# Altium schematic sheet Sheet2.SchDoc
size A4
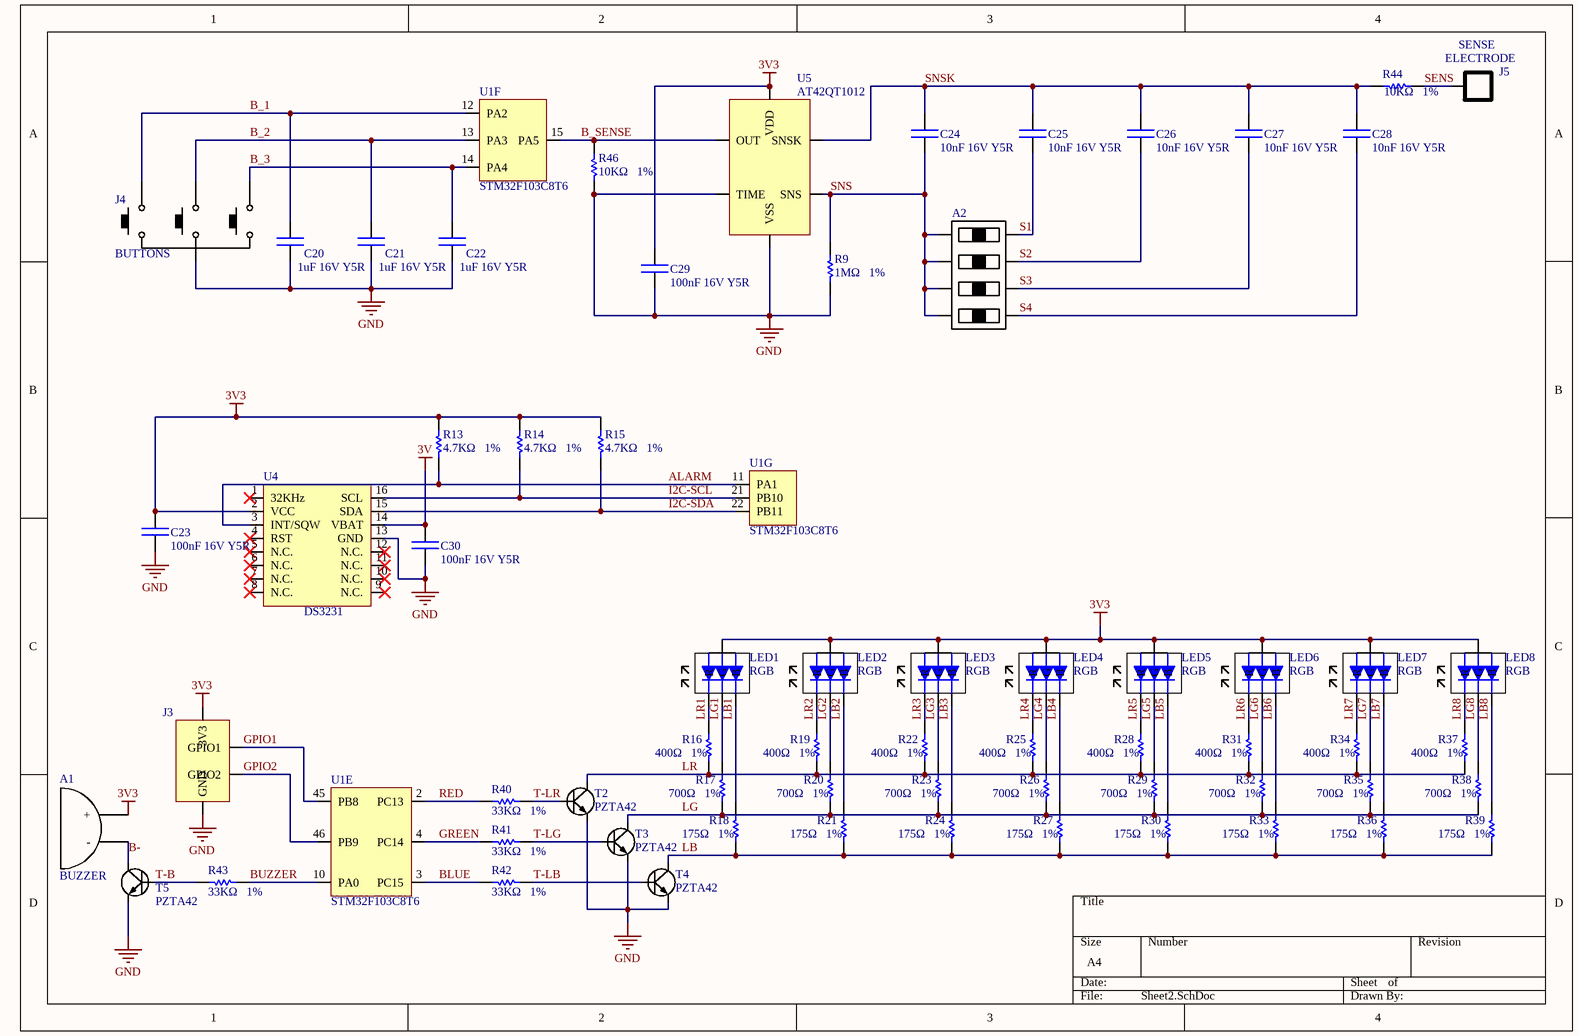
[diagram p0: Sheet2.SchDoc]

## Parts
A1  BUZZER  [BUZZER]
A2  DIP-SWITCHx4  [DIP-SWITCH-X4-J-BEND]  (value not drawn)
C20  1uF 16V Y5R  [0603]
C21  1uF 16V Y5R  [0603]
C22  1uF 16V Y5R  [0603]
C23  100nF 16V Y5R  [0603]
C24  10nF 16V Y5R  [0603]
C25  10nF 16V Y5R  [0603]
C26  10nF 16V Y5R  [0603]
C27  10nF 16V Y5R  [0603]
C28  10nF 16V Y5R  [0603]
C29  100nF 16V Y5R  [0603]
C30  100nF 16V Y5R  [0603]
J3  GPIO  [PIN-HEADERx4-]  (value not drawn)
J4  BUTTONS  [BORNERAx4]
J5  ELECTRODE  [BORNERAx2]
LED1  RGB  [1205-RGB]
LED2  RGB  [1205-RGB]
LED3  RGB  [1205-RGB]
LED4  RGB  [1205-RGB]
LED5  RGB  [1205-RGB]
LED6  RGB  [1205-RGB]
LED7  RGB  [1205-RGB]
LED8  RGB  [1205-RGB]
R9  1MΩ   1%  [0603]
R13  4.7KΩ   1%  [0603]
R14  4.7KΩ   1%  [0603]
R15  4.7KΩ   1%  [0603]
R16  400Ω   1%  [0603]
R17  700Ω   1%  [0603]
R18  175Ω   1%  [0603]
R19  400Ω   1%  [0603]
R20  700Ω   1%  [0603]
R21  175Ω   1%  [0603]
R22  400Ω   1%  [0603]
R23  700Ω   1%  [0603]
R24  175Ω   1%  [0603]
R25  400Ω   1%  [0603]
R26  700Ω   1%  [0603]
R27  175Ω   1%  [0603]
R28  400Ω   1%  [0603]
R29  700Ω   1%  [0603]
R30  175Ω   1%  [0603]
R31  400Ω   1%  [0603]
R32  700Ω   1%  [0603]
R33  175Ω   1%  [0603]
R34  400Ω   1%  [0603]
R35  700Ω   1%  [0603]
R36  175Ω   1%  [0603]
R37  400Ω   1%  [0603]
R38  700Ω   1%  [0603]
R39  175Ω   1%  [0603]
R40  33KΩ   1%  [0603]
R41  33KΩ   1%  [0603]
R42  33KΩ   1%  [0603]
R43  33KΩ   1%  [0603]
R44  10KΩ   1%  [0603]
R46  10KΩ   1%  [0603]
T2  PZTA42  [SOT-23]
T3  PZTA42  [SOT-23]
T4  PZTA42  [SOT-23]
T5  PZTA42  [SOT-23]
U1  STM32F103C8T6  [LQFP48]  (parts E,F,G of 8)
U4  DS3231  [SO16W]
U5  AT42QT1012  [SOT-23-6]

## Nets
3V: C30.2 U4.14(VBAT)
3V3: A1.1(+) C23.2 C29.1 J3.1(3V3) LED1.2(A) LED2.2(A) LED3.2(A) LED4.2(A) LED5.2(A) LED6.2(A) LED7.2(A) LED8.2(A) R13.2 R14.2 R15.2 U4.2(VCC) U5.5(VDD)
GND: C20.1 C21.1 C22.1 C23.1 C29.2 C30.1 J3.4(GND) J4.4 R9.2 R46.1 T2.2(E) T3.2(E) T4.2(E) T5.2(E) U4.13(GND) U5.2(VSS) U5.6(TIME)
ALARM: R13.1 U1.11(PA1) U4.3(INT/SQW)
B-: A1.2(-) T5.3(C)
B_1: C20.2 J4.1 U1.12(PA2)
B_2: C21.2 J4.2 U1.13(PA3)
B_3: C22.2 J4.3 U1.14(PA4)
B_SENSE: R46.2 U1.15(PA5) U5.1(OUT)
BLUE: R42.1 U1.3(PC15)
BUZZER: R43.2 U1.10(PA0)
GPIO1: J3.2(GPIO1) U1.45(PB8)
GPIO2: J3.3(GPIO2) U1.46(PB9)
GREEN: R41.1 U1.4(PC14)
I2C-SCL: R14.1 U1.21(PB10) U4.16(SCL)
I2C-SDA: R15.1 U1.22(PB11) U4.15(SDA)
LB: R18.1 R21.1 R24.1 R27.1 R30.1 R33.1 R36.1 R39.1 T4.3(C)
LB1: LED1.3(B) R18.2
LB2: LED2.3(B) R21.2
LB3: LED3.3(B) R24.2
LB4: LED4.3(B) R27.2
LB5: LED5.3(B) R30.2
LB6: LED6.3(B) R33.2
LB7: LED7.3(B) R36.2
LB8: LED8.3(B) R39.2
LG: R17.1 R20.1 R23.1 R26.1 R29.1 R32.1 R35.1 R38.1 T3.3(C)
LG1: LED1.4(G) R17.2
LG2: LED2.4(G) R20.2
LG3: LED3.4(G) R23.2
LG4: LED4.4(G) R26.2
LG5: LED5.4(G) R29.2
LG6: LED6.4(G) R32.2
LG7: LED7.4(G) R35.2
LG8: LED8.4(G) R38.2
LR: R16.1 R19.1 R22.1 R25.1 R28.1 R31.1 R34.1 R37.1 T2.3(C)
LR1: LED1.1(R) R16.2
LR2: LED2.1(R) R19.2
LR3: LED3.1(R) R22.2
LR4: LED4.1(R) R25.2
LR5: LED5.1(R) R28.2
LR6: LED6.1(R) R31.2
LR7: LED7.1(R) R34.2
LR8: LED8.1(R) R37.2
RED: R40.1 U1.2(PC13)
S1: A2.8 C25.2
S2: A2.7 C26.2
S3: A2.6 C27.2
S4: A2.5 C28.2
SENS: J5.1 R44.1
SNS: A2.1 A2.2 A2.3 A2.4 C24.2 R9.1 U5.4(SNS)
SNSK: C24.1 C25.1 C26.1 C27.1 C28.1 R44.2 U5.3(SNSK)
T-B: R43.1 T5.1(B)
T-LB: R42.2 T4.1(B)
T-LG: R41.2 T3.1(B)
T-LR: R40.2 T2.1(B)

Not connected (* = marked no-connect by the designer): U4 1(32KHz)* 4(RST)* 5(N.C.)* 6(N.C.)* 7(N.C.)* 8(N.C.)* 9(N.C.)* 10(N.C.)* 11(N.C.)* 12(N.C.)*

## Notes on the sheet
- (near J5) SENSE

## Library data of the parts
C20-C30 = CAP
J4 = BUTTONx3
R9 R13-R44 R46 = RES
T2-T5 = NPN